# Altium schematic sheet TWindow.SchDoc: LiveDesign Evaluation - Alarm Clock
size A3; Organization: Altium Limited; Address1: L3, 12a Rodborough Rd; Address2: Frenchs Forest; Address3: NSW; Address4: Australia 2086; DocumentNumber: 10; SheetNumber: 10; SheetTotal: 10
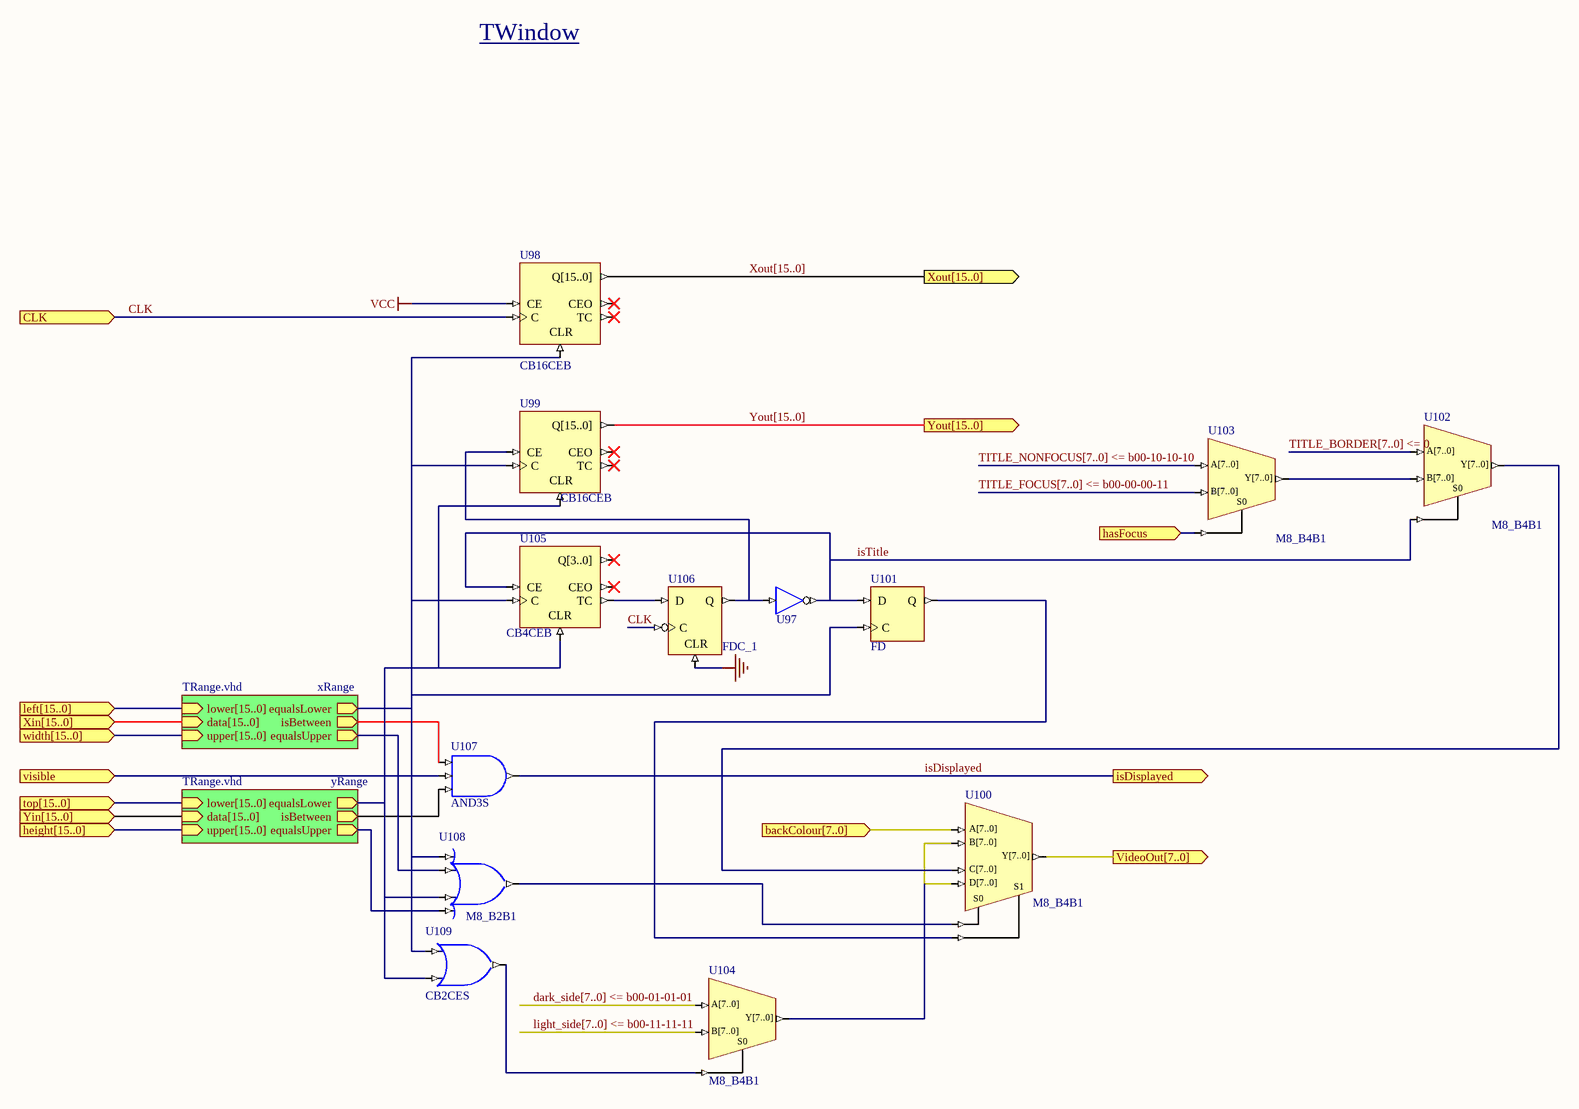
[diagram p0: TWindow.SchDoc]

## Parts
U97  INV  (value not drawn)
U98  CB16CEB
U99  CB16CEB
U100  M8_B4B1
U101  FD
U102  M8_B4B1
U103  M8_B4B1
U104  M8_B4B1
U105  CB4CEB
U106  FDC_1
U107  AND3S
U108  M8_B2B1
U109  CB2CES

## Sub-sheets
xRange = TRange.vhd: lower[15..0] (in), data[15..0] (in), upper[15..0] (in), isBetween (out), equalsLower (out), equalsUpper (out)
yRange = TRange.vhd: lower[15..0] (in), data[15..0] (in), upper[15..0] (in), isBetween (out), equalsLower (out), equalsUpper (out)

## Ports
backColour[7..0] (in), CLK (in), hasFocus (in), height[15..0] (in), isDisplayed (out), left[15..0] (in), top[15..0] (in), VideoOut[7..0] (out), visible (in), width[15..0] (in), Xin[15..0] (in), Xout[15..0] (out), Yin[15..0] (in), Yout[15..0] (out)

## Nets
GND: U106.CLR
VCC: U98.CE
backColour[7..0]: U100.A[7..0] ; port backColour[7..0]
CLK: U98.C U106.C ; port CLK
dark_side[7..0] <= b00-01-01-01: U104.A[7..0]
hasFocus: U103.S0 ; port hasFocus
isDisplayed: U107.O ; port isDisplayed
isTitle: U97.O U101.D U102.S0 U105.CE
light_side[7..0] <= b00-11-11-11: U104.B[7..0]
TITLE_BORDER[7..0] <= 0: U102.A[7..0]
TITLE_FOCUS[7..0] <= b00-00-00-11: U103.B[7..0]
TITLE_NONFOCUS[7..0] <= b00-10-10-10: U103.A[7..0]
VideoOut[7..0]: U100.Y[7..0] ; port VideoOut[7..0]
visible: U107.I1 ; port visible
Xout[15..0]: U98.Q[15..0] ; port Xout[15..0]
Yout[15..0]: U99.Q[15..0] ; port Yout[15..0]
NetU97_I: U97.I U99.CE U106.Q
NetU98_CLR: U98.CLR U99.C U101.C U105.C U108.I0 U109.I0 ; sheet xRange/equalsLower
NetU99_CLR: U99.CLR U105.CLR U108.I2 U109.I1 ; sheet yRange/equalsLower
NetU100_B[7..0]: U100.B[7..0] U100.D[7..0] U104.Y[7..0]
NetU100_C[7..0]: U100.C[7..0] U102.Y[7..0]
NetU100_S0: U100.S0 U108.O
NetU100_S1: U100.S1 U101.Q
NetU102_B[7..0]: U102.B[7..0] U103.Y[7..0]
NetU104_S0: U104.S0 U109.O
NetU105_TC: U105.TC U106.D
NetU107_I0: U107.I0 ; sheet xRange/isBetween
NetU107_I2: U107.I2 ; sheet yRange/isBetween
NetU108_I1: U108.I1 ; sheet xRange/equalsUpper
NetU108_I3: U108.I3 ; sheet yRange/equalsUpper

Not connected (* = marked no-connect by the designer): U98 CEO* TC*; U99 CEO* TC*; U105 CEO* Q[3..0]*

## Buses and harness runs
bus dark_side[7..0] <= b00-01-01-01
bus light_side[7..0] <= b00-11-11-11
bus port height[15..0] = sheet yRange/upper[15..0]
bus port left[15..0] = sheet xRange/lower[15..0]
bus port top[15..0] = sheet yRange/lower[15..0]
bus port width[15..0] = sheet xRange/upper[15..0]
bus port Xin[15..0] = sheet xRange/data[15..0]
bus port Yin[15..0] = sheet yRange/data[15..0]
bus TITLE_BORDER[7..0] <= 0
bus TITLE_FOCUS[7..0] <= b00-00-00-11
bus TITLE_NONFOCUS[7..0] <= b00-10-10-10
bus Xout[15..0] = port Xout[15..0]
bus Yout[15..0] = port Yout[15..0]

## Notes on the sheet
- TWindow
- Title
- Size:
- Date:
- A3
- Number:
- Time:
- Revision:
- Sheet
- of
- File:

## Library data of the parts
U97 = INV: Inverter; ArchiveName: GENERIC; VHDLIB_SIM: GENERIC_LIB; Published: 29-Jan-2004; Publisher: Altium Limited; Xilinx Equivalent: INV; Core Revision: 1.00.00
U98 U99 = CB16CEB: 16-Bit Cascadable Binary Counters with Clock Enable and Asynchronous Clear, Bus Version; Xilinx Equivalent: CB16CE; ArchiveName: GENERIC; VHDLIB_SIM: GENERIC_LIB; Published: 29-Jan-2004; Publisher: Altium Limited; Core Revision: 1.00.00
U100 = M8_B4B1: 4x8-Bit Bus to 1x8-Bit Bus Multiplexer; ArchiveName: GENERIC; VHDLIB_SIM: GENERIC_LIB; Published: 29-Jan-2004; Publisher: Altium Limited; Core Revision: 1.00.00
U101 = FD: D-Type Flip-Flop; ArchiveName: GENERIC; VHDLIB_SIM: GENERIC_LIB; Published: 29-Jan-2004; Publisher: Altium Limited; Xilinx Equivalent: FD; Core Revision: 1.00.00
U102-U104 = M8_B2B1: 2x8-Bit Bus to 1x8-Bit Bus Multiplexer; ArchiveName: GENERIC; VHDLIB_SIM: GENERIC_LIB; Published: 29-Jan-2004; Publisher: Altium Limited; Core Revision: 1.00.00
U105 = CB4CEB: 4-Bit Cascadable Binary Counters with Clock Enable and Asynchronous Clear, Bus Version; ArchiveName: GENERIC; VHDLIB_SIM: GENERIC_LIB; Published: 29-Jan-2004; Publisher: Altium Limited; Core Revision: 1.00.00
U106 = FDC_1: D-Type Negative Edge Flip-Flop with Asynchronous Clear; ArchiveName: GENERIC; VHDLIB_SIM: GENERIC_LIB; Published: 29-Jan-2004; Publisher: Altium Limited; Xilinx Equivalent: FDC_1; Core Revision: 1.00.00
U107 = AND3S: 3-Input AND Gate, Single Pin Version; Xilinx Equivalent: AND3; ArchiveName: GENERIC; VHDLIB_SIM: GENERIC_LIB; Published: 29-Jan-2004; Publisher: Altium Limited; Core Revision: 1.00.00
U108 = OR4S: 4-Input OR Gate, Single Pin Version; Xilinx Equivalent: OR4; ArchiveName: GENERIC; VHDLIB_SIM: GENERIC_LIB; Published: 29-Jan-2004; Publisher: Altium Limited; Core Revision: 1.00.00
U109 = OR2S: 2-Input OR Gate, Single Pin Version; Xilinx Equivalent: OR2; ArchiveName: GENERIC; VHDLIB_SIM: GENERIC_LIB; Published: 29-Jan-2004; Publisher: Altium Limited; Core Revision: 1.00.00